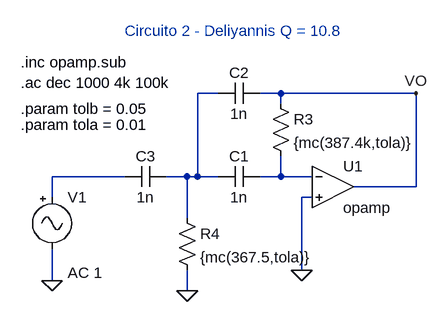
[diagram p0: schematic Circuito2.asc]
Circuito2.asc, the LTspice schematic file:
Version 4
SHEET 1 880 680
WIRE 32 32 0 32
WIRE 128 32 96 32
WIRE 336 32 128 32
WIRE 128 48 128 32
WIRE -112 160 -224 160
WIRE -16 160 -48 160
WIRE 0 160 0 32
WIRE 0 160 -16 160
WIRE 32 160 0 160
WIRE 128 160 128 128
WIRE 128 160 96 160
WIRE 176 160 128 160
WIRE 336 176 336 32
WIRE 336 176 240 176
WIRE -224 192 -224 160
WIRE 176 192 160 192
WIRE -16 224 -16 160
WIRE 160 304 160 192
WIRE -224 320 -224 272
WIRE -16 336 -16 304
FLAG -16 336 0
FLAG 336 32 VO
FLAG -224 320 0
FLAG 160 304 0
SYMBOL Opamps\\opamp 208 112 R0
SYMATTR InstName U1
SYMBOL cap 96 144 R90
WINDOW 0 0 32 VBottom 2
WINDOW 3 32 32 VTop 2
SYMATTR InstName C1
SYMATTR Value 1n
SYMBOL cap 96 16 R90
WINDOW 0 0 32 VBottom 2
WINDOW 3 32 32 VTop 2
SYMATTR InstName C2
SYMATTR Value 1n
SYMBOL res 112 32 R0
SYMATTR InstName R3
SYMATTR Value {mc(387.4k,tola)}
SYMBOL cap -48 144 R90
WINDOW 0 0 32 VBottom 2
WINDOW 3 32 32 VTop 2
SYMATTR InstName C3
SYMATTR Value 1n
SYMBOL res -32 208 R0
SYMATTR InstName R4
SYMATTR Value {mc(367.5,tola)}
SYMBOL Misc\\signal -224 176 R0
WINDOW 123 24 132 Left 2
WINDOW 39 0 0 Left 2
SYMATTR Value2 AC 1
SYMATTR InstName V1
SYMATTR Value ""
TEXT -272 -16 Left 2 !.inc opamp.sub
TEXT -272 16 Left 2 !.ac dec 1000 4k 100k
TEXT -272 56 Left 2 !.param tolb = 0.05
TEXT -272 80 Left 2 !.param tola = 0.01
TEXT -112 -64 Left 2 ;Circuito 2 - Deliyannis Q = 10.8

The netlist it stands for:
* Circuito2.asc
XU1 N003 0 VO opamp Aol=100K GBW=10Meg  ; pins invin noninvin out
C1 N003 N001 1n
C2 VO N001 1n
R3 VO N003 {mc(387.4k,tola)}
C3 N001 N002 1n
R4 N001 0 {mc(367.5,tola)}
V1 N002 0 AC 1
.inc opamp.sub
.ac dec 1000 4k 100k
.param tolb = 0.05
.param tola = 0.01
* Circuito 2 - Deliyannis Q = 10.8
.backanno
.end